# Altium schematic sheet bg_MCU.SchDoc
size A2
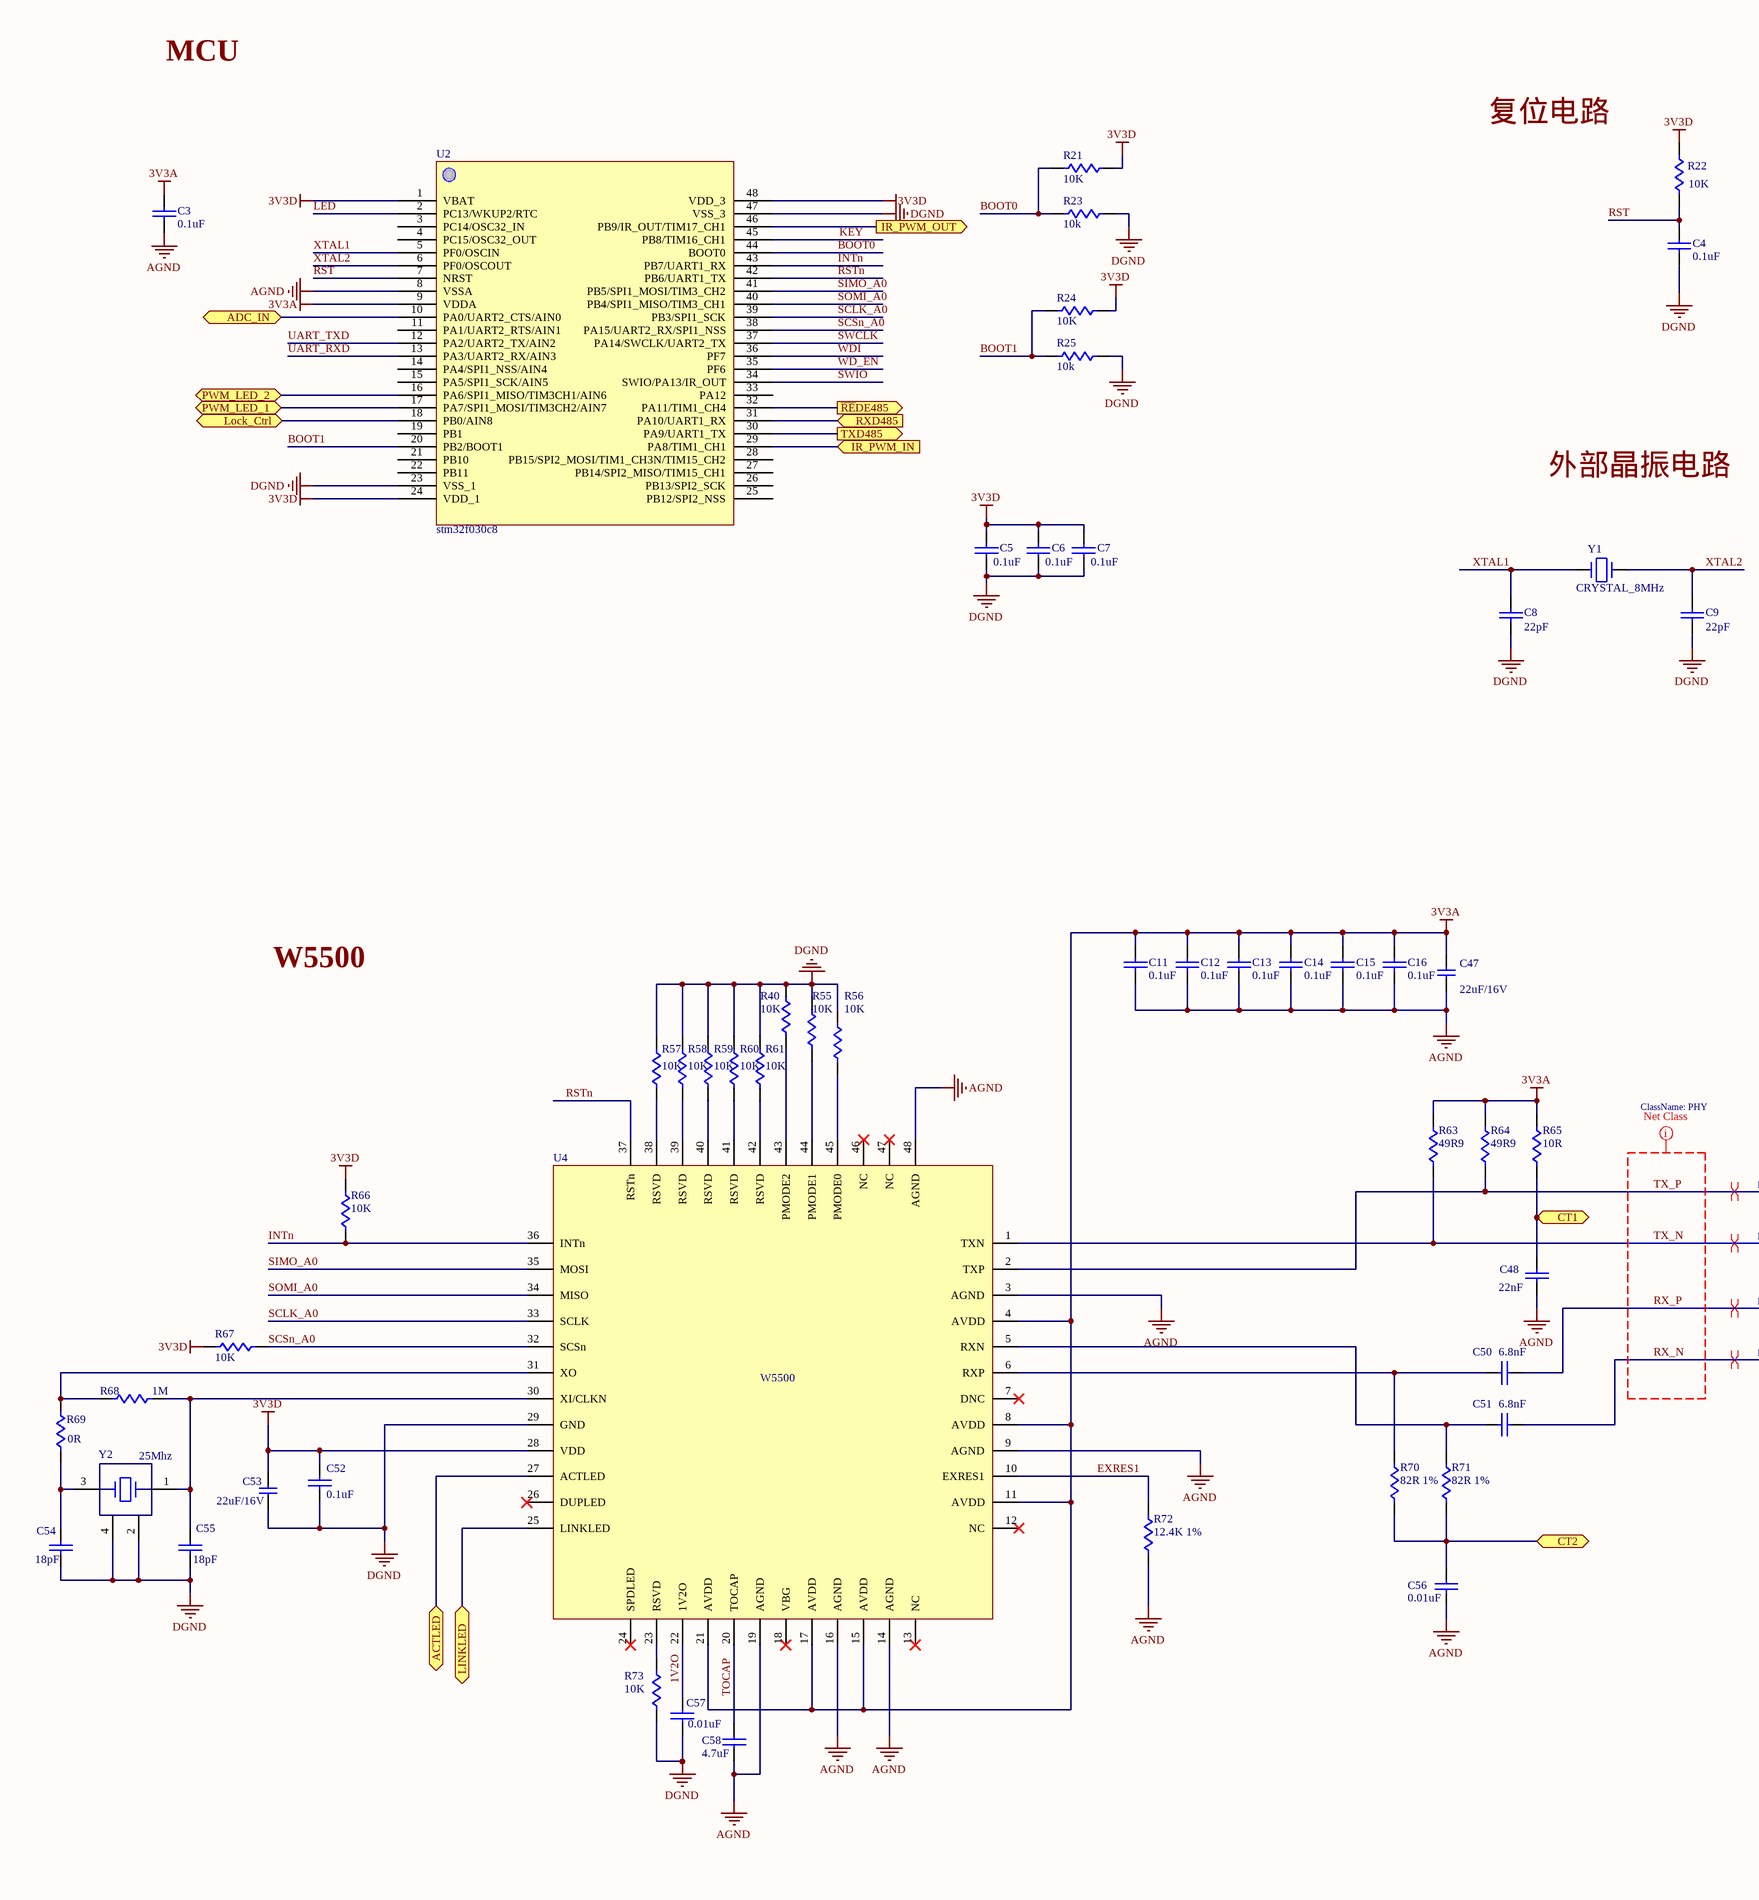
[diagram p0: bg_MCU.SchDoc, left]
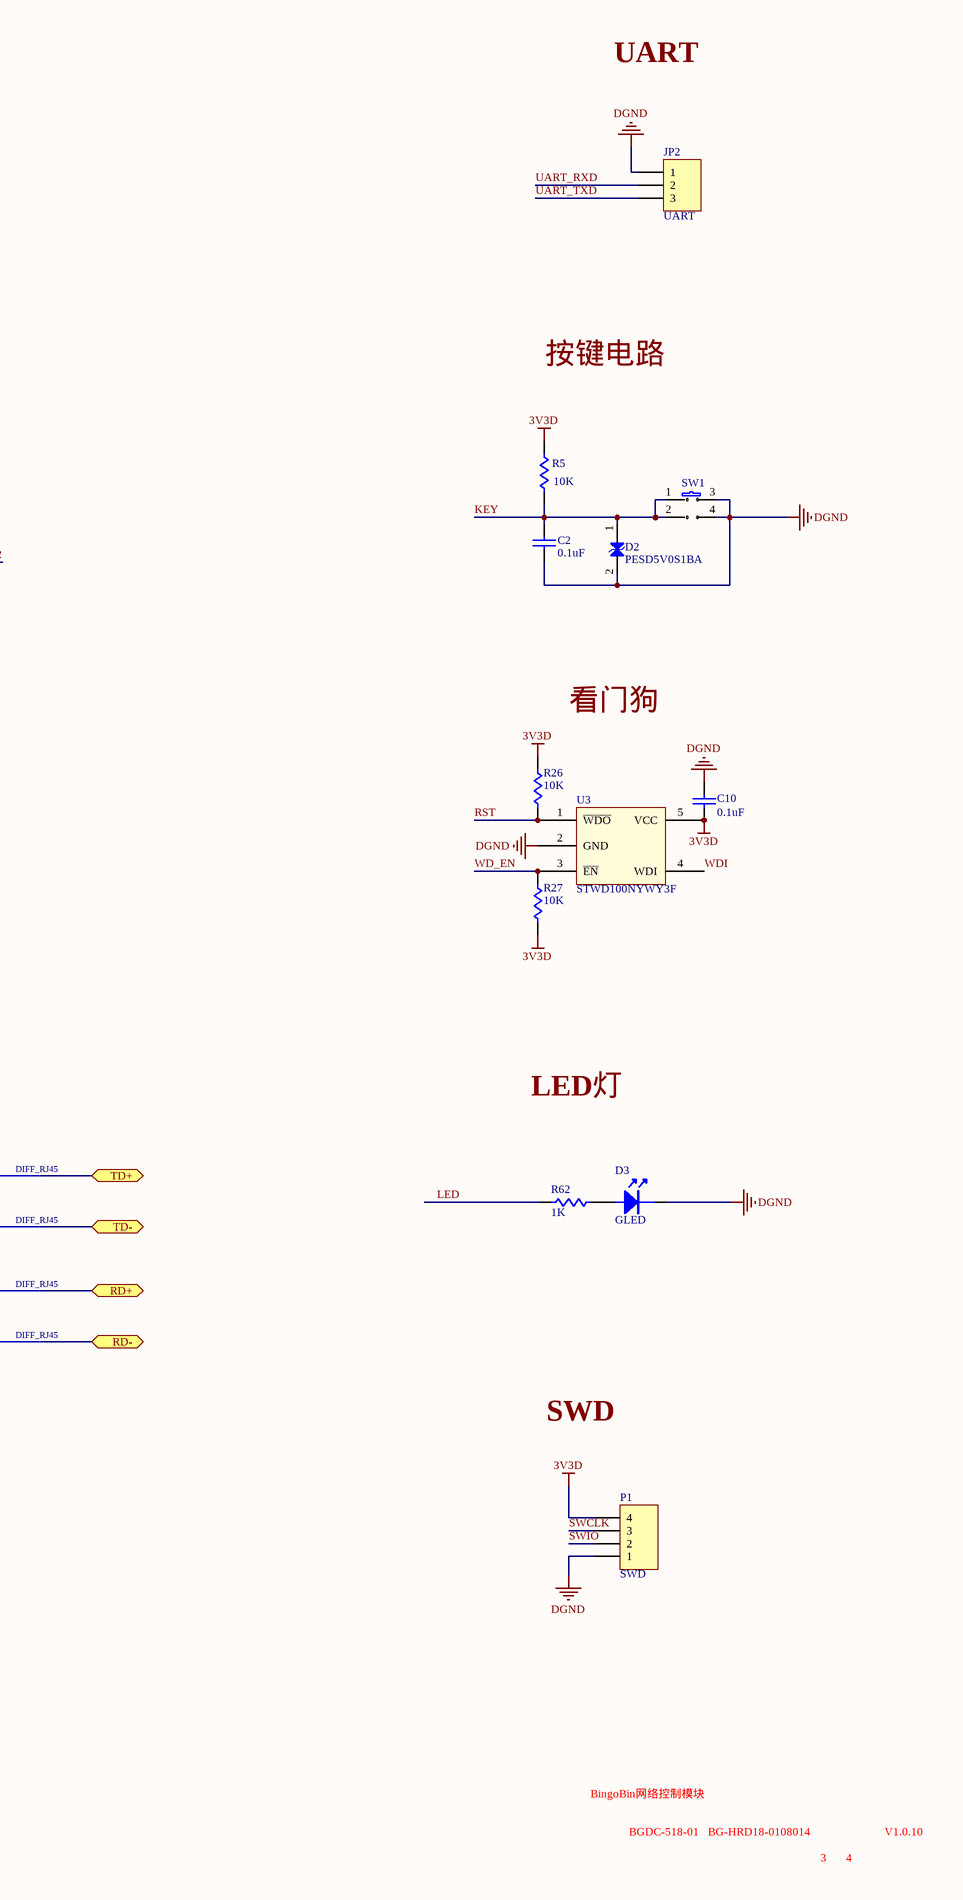
[diagram p1: bg_MCU.SchDoc, right]

## Parts
C2  0.1uF  [C0603]
C3  0.1uF  [C0603]
C4  0.1uF  [C0603]
C5  0.1uF  [C0603]
C6  0.1uF  [C0603]
C7  0.1uF  [C0603]
C8  22pF  [C0603]
C9  22pF  [C0603]
C10  0.1uF  [C0603]
C11  0.1uF  [C0603]
C12  0.1uF  [C0603]
C13  0.1uF  [C0603]
C14  0.1uF  [C0603]
C15  0.1uF  [C0603]
C16  0.1uF  [C0603]
C47  22uF/16V  [C1210]
C48  22nF  [C0603]
C50  6.8nF  [C0603]
C51  6.8nF  [C0603]
C52  0.1uF  [C0603]
C53  22uF/16V  [C1210]
C54  18pF  [C0603]
C55  18pF  [C0603]
C56  0.01uF  [C0603]
C57  0.01uF  [C0603]
C58  4.7uF  [C0603]
D2  PESD5V0S1BA  [SOD323]
D3  GLED  [LED-0805]
JP2  UART  [HDR1X3]
P1  SWD  [HDR1X4]
R5  10K  [R0603]
R21  10K  [R0603]
R22  10K  [R0603]
R23  10k  [R0603]
R24  10K  [R0603]
R25  10k  [R0603]
R26  10K  [R0603]
R27  10K  [R0603]
R40  10K  [R0603]
R55  10K  [R0603]
R56  10K  [R0603]
R57  10K  [R0603]
R58  10K  [R0603]
R59  10K  [R0603]
R60  10K  [R0603]
R61  10K  [R0603]
R62  1K  [R0603]
R63  49R9  [R0603]
R64  49R9  [R0603]
R65  10R  [R0603]
R66  10K  [R0603]
R67  10K  [R0603]
R68  1M  [R0603]
R69  0R  [R0603]
R70  82R 1%  [R0603]
R71  82R 1%  [R0603]
R72  12.4K 1%  [R0603]
R73  10K  [R0603]
SW1  K2-6639SP-I4SC-04  [KEY6*6mm]  (value not drawn)
U2  stm32f030c8  [LQFP48]
U3  STWD100NYWY3F  [SOT23-5]
U4  W5500  [W5500-LQFP-48_7x7x05P]
Y1  CRYSTAL_8MHz  [8M_SMD_CRYSTAL]
Y2  25Mhz  [25MHz-SMD-3225_4P]

## Ports
ACTLED (bidir), ADC_IN, CT1 (bidir), CT2 (bidir), IR_PWM_IN (in), IR_PWM_OUT (out), LINKLED (bidir), Lock_Ctrl, PWM_LED_1, PWM_LED_2, RD+ (bidir), RD- (bidir), RXD485 (in), TD+ (bidir), TD- (bidir), TXD485 (out), ~{RE}DE485 (out)

## Nets
3V3A: C3.1 C11.1 C12.1 C13.1 C14.1 C15.1 C16.1 C47.2 R63.2 R64.2 R65.2 U2.9(VDDA) U4.4(AVDD) U4.8(AVDD) U4.11(AVDD) U4.15(AVDD) U4.17(AVDD) U4.21(AVDD)
3V3D: C5.2 C6.2 C7.2 C10.2 C52.1 C53.2 P1.4 R5.2 R21.1 R22.2 R24.1 R26.2 R27.1 R66.2 R67.2 U2.1(VBAT) U2.24(VDD_1) U2.48(VDD_3) U3.5(VCC) U4.28(VDD)
AGND: C3.2 C11.2 C12.2 C13.2 C14.2 C15.2 C16.2 C47.1 C48.2 C56.2 C58.2 R72.1 U2.8(VSSA) U4.3(AGND) U4.9(AGND) U4.14(AGND) U4.16(AGND) U4.19(AGND) U4.48(AGND)
DGND: C2.1 C4.1 C5.1 C6.1 C7.1 C8.2 C9.2 C10.1 C52.2 C53.1 C54.2 C55.2 C57.2 D2.2 D3.2 JP2.1 P1.1 R23.1 R25.1 R40.2 R55.2 R56.2 R57.2 R58.2 R59.2 R60.2 R61.2 R73.1 SW1.3 SW1.4 U2.23(VSS_1) U2.47(VSS_3) U3.2(GND) U4.29(GND) Y2.2 Y2.4
1V2O: C57.1 U4.22(1V2O)
ACTLED: U4.27(ACTLED) ; port ACTLED
ADC_IN: U2.10(PA0/UART2_CTS/AIN0) ; port ADC_IN
BOOT0: R21.2 R23.2 U2.44(BOOT0)
BOOT1: R24.2 R25.2 U2.20(PB2/BOOT1)
CT1: C48.1 R65.1 ; port CT1
CT2: C56.1 R70.1 R71.1 ; port CT2
EXRES1: R72.2 U4.10(EXRES1)
INTn: R66.1 U2.43(PB7/UART1_RX) U4.36(INTn)
IR_PWM_IN: U2.29(PA8/TIM1_CH1) ; port IR_PWM_IN
IR_PWM_OUT: U2.46(PB9/IR_OUT/TIM17_CH1) ; port IR_PWM_OUT
KEY: C2.2 D2.1 R5.1 SW1.1 SW1.2 U2.45(PB8/TIM16_CH1)
LED: R62.2 U2.2(PC13/WKUP2/RTC)
LINKLED: U4.25(LINKLED) ; port LINKLED
Lock_Ctrl: U2.18(PB0/AIN8) ; port Lock_Ctrl
PWM_LED_1: U2.17(PA7/SPI1_MOSI/TIM3CH2/AIN7) ; port PWM_LED_1
PWM_LED_2: U2.16(PA6/SPI1_MISO/TIM3CH1/AIN6) ; port PWM_LED_2
~{RE}DE485: U2.32(PA11/TIM1_CH4) ; port ~{RE}DE485
RST: C4.2 R22.1 R26.1 U2.7(NRST) U3.1(~{WDO})
RSTn: U2.42(PB6/UART1_TX) U4.37(RSTn)
RX_N: C51.2 ; port RD-
RX_P: C50.2 ; port RD+
RXD485: U2.31(PA10/UART1_RX) ; port RXD485
SCLK_A0: U2.39(PB3/SPI1_SCK) U4.33(SCLK)
SCSn_A0: R67.1 U2.38(PA15/UART2_RX/SPI1_NSS) U4.32(SCSn)
SIMO_A0: U2.41(PB5/SPI1_MOSI/TIM3_CH2) U4.35(MOSI)
SOMI_A0: U2.40(PB4/SPI1_MISO/TIM3_CH1) U4.34(MISO)
SWCLK: P1.3 U2.37(PA14/SWCLK/UART2_TX)
SWIO: P1.2 U2.34(SWIO/PA13/IR_OUT)
TOCAP: C58.1 U4.20(TOCAP)
TX_N: R63.1 U4.1(TXN) ; port TD-
TX_P: R64.1 U4.2(TXP) ; port TD+
TXD485: U2.30(PA9/UART1_TX) ; port TXD485
UART_RXD: JP2.2 U2.13(PA3/UART2_RX/AIN3)
UART_TXD: JP2.3 U2.12(PA2/UART2_TX/AIN2)
WD_EN: R27.2 U2.35(PF6) U3.3(~{EN})
WDI: U2.36(PF7) U3.4(WDI)
XTAL1: C8.1 U2.5(PF0/OSCIN) Y1.1
XTAL2: C9.1 U2.6(PF0/OSCOUT) Y1.2
NetC50_1: C50.1 R70.2 U4.6(RXP)
NetC51_1: C51.1 R71.2 U4.5(RXN)
NetC54_1: C54.1 R69.1 Y2.3
NetC55_1: C55.1 R68.1 U4.30(XI/CLKN) Y2.1
NetD3_1: D3.1 R62.1
NetR40_1: R40.1 U4.43(PMODE2)
NetR55_1: R55.1 U4.44(PMODE1)
NetR56_1: R56.1 U4.45(PMODE0)
NetR57_1: R57.1 U4.38(RSVD)
NetR58_1: R58.1 U4.39(RSVD)
NetR59_1: R59.1 U4.40(RSVD)
NetR60_1: R60.1 U4.41(RSVD)
NetR61_1: R61.1 U4.42(RSVD)
NetR68_2: R68.2 R69.2 U4.31(XO)
NetR73_2: R73.2 U4.23(RSVD)

Not connected (* = marked no-connect by the designer): U2 3(PC14/OSC32_IN) 4(PC15/OSC32_OUT) 11(PA1/UART2_RTS/AIN1) 14(PA4/SPI1_NSS/AIN4) 15(PA5/SPI1_SCK/AIN5) 19(PB1) 21(PB10) 22(PB11) 25(PB12/SPI2_NSS) 26(PB13/SPI2_SCK) 27(PB14/SPI2_MISO/TIM15_CH1) 28(PB15/SPI2_MOSI/TIM1_CH3N/TIM15_CH2) 33(PA12); U4 7(DNC)* 12(NC)* 13(NC)* 18(VBG)* 24(SPDLED)* 26(DUPLED)* 46(NC)* 47(NC)*

## Layout directives
differential pair; net class DIFF_RJ45: RX_N, RX_P, TX_N, TX_P
net class PHY: RX_N, RX_P, TX_N, TX_P

## Notes on the sheet
- MCU
- UART
- 复位电路
- 按键电路
- 外部晶振电路
- 看门狗
- W5500
- LED灯
- SWD
- BingoBin网络控制模块
- BGDC-518-01   BG-HRD18-0108014
- 3
- 4
- V1.0.10

## Library data of the parts
C2-C7 C10-C16 C52 = C0603: Capacitor, Ceramic, 0.1uF, 16V, 10%, 0603, X7R; Value: 0.1uF
C8 C9 = C0603: Capacitor, Ceramic, 22pF, 50V, 5%, 0603, COG; Value: 22pF
C47 C53 = CAP_0603: Capacitor, Ceramic, 10uF,16V, 10%,1210,X5R; Part Number: C0603-4µ7; Note: 6.3V; Artikkelnr Noca: 20069060; Artikkelnr Simpro: N.A.; Manufacturer: *; Manufacturer Part Number: *; Datasheet: *; LatestRevisionDate: 2009-11-23; Pin Count: 2; Publisher: Nordic Semiconductor; Published: 2009-05-08; Value: 22uF/16V; Supplier: *; Supplier part number: *; 2nd source Supplier: *; 2nd source part number: *; Footprint Doc: 0603
C48 = C0603: Capacitor, Ceramic, 22nF, 25V, 10%, 0603, X7R; Value: 22nF
C50 C51 = C0603: Capacitor, Ceramic, 6.8nF, 50V, 10%, 0603, X7R; Value: 6.8nF
C54 C55 = C0603: Capacitor, Ceramic, 18pF, 50V, 5%, 0603, COG; Value: 18pF
C56 C57 = C0603: Capacitor, Ceramic, 0.01uF, 50V, 10%, 0603, X7R; Value: 0.01uF
C58 = C0603: Capacitor, Ceramic, 4.7uF, 16V, 10%, 0603, X7R; Value: 4.7uF
D2 = ESD: Manufacturer: NXP; Manufacturer Part Number: PESD5V0S1BA; Value: PESD5V0S1BA
D3 = LED_0805: 翠绿色 贴片LED ( Iv=220-270mcd @IF=5mA)
JP2 = Header 3: Header, 3-Pin, Single row; LatestRevisionDate: 17-Jul-2002; LatestRevisionNote: Re-released for DXP Platform.; Publisher: Altium Limited
P1 = Header 4: Header, 4-Pin; LatestRevisionDate: 17-Jul-2002; LatestRevisionNote: Re-released for DXP Platform.; Publisher: Altium Limited
R5 R21-R25 = R0603: RES, THICK FILM, 4.7K, 5%, 1/10W, 0603
  R5 R21 R22 R24: Value: 10K
  R23 R25: Value: 10k
R26 R27 R40 R55-R61 R66 R67 R73 = R0603: RES, THICK FILM, 10K, 5%, 1/10W, 0603; Value: 10K
R62 = R0603: RES, THICK FILM, 1K, 5%, 1/10W, 0603; Value: 1K
R63 R64 = R0603: RES, THICK FILM, 49.9 OHM, 1%, 1/10W, 0603; Value: 49R9
R65 = R0603: RES, THICK FILM, 10 OHM, 5%, 1/10W, 0603; Value: 10R
R68 = R0603: RES, THICK FILM, 1M, 5%, 1/10W, 0603; Value: 1M
R69 = R0603: RES, THICK FILM, 0 OHM, 1%, 1/10W, 0603; Value: 0R
R70 R71 = R0603: RES, THICK FILM, 82 OHM, 5%, 1/10W, 0603; Value: 82R 1%
R72 = R0603: RES, THICK FILM, 12.4K, 1%, 1/10W, 0603; Value: 12.4K 1%
SW1 = SW: Manufacturer: 韩国韩荣; Manufacturer Part Number: K2-6639SP-I4SC-04; Value: K2-6639SP-I4SC-04
U2 = stm32f030c8: mcu  LQFP-48_7x7x05P
U3 = STWD100: Watchdog timer circuit/1.6s; PCB DECAL: *; Source_Path: *; Value: *
U4 = W5500: TCP/IP嵌入式以太网控制器
Y1 = CRYSTAL_32.768k: 20PF 20PPM -40~+85℃ 编带
Y2 = 25Mhz: XTAL S3225 25M 12pF 10ppm 40R -20~70℃